# Altium schematic sheet DRIVER.SchDoc
size A4; SheetNumber: 3; SheetTotal: 4
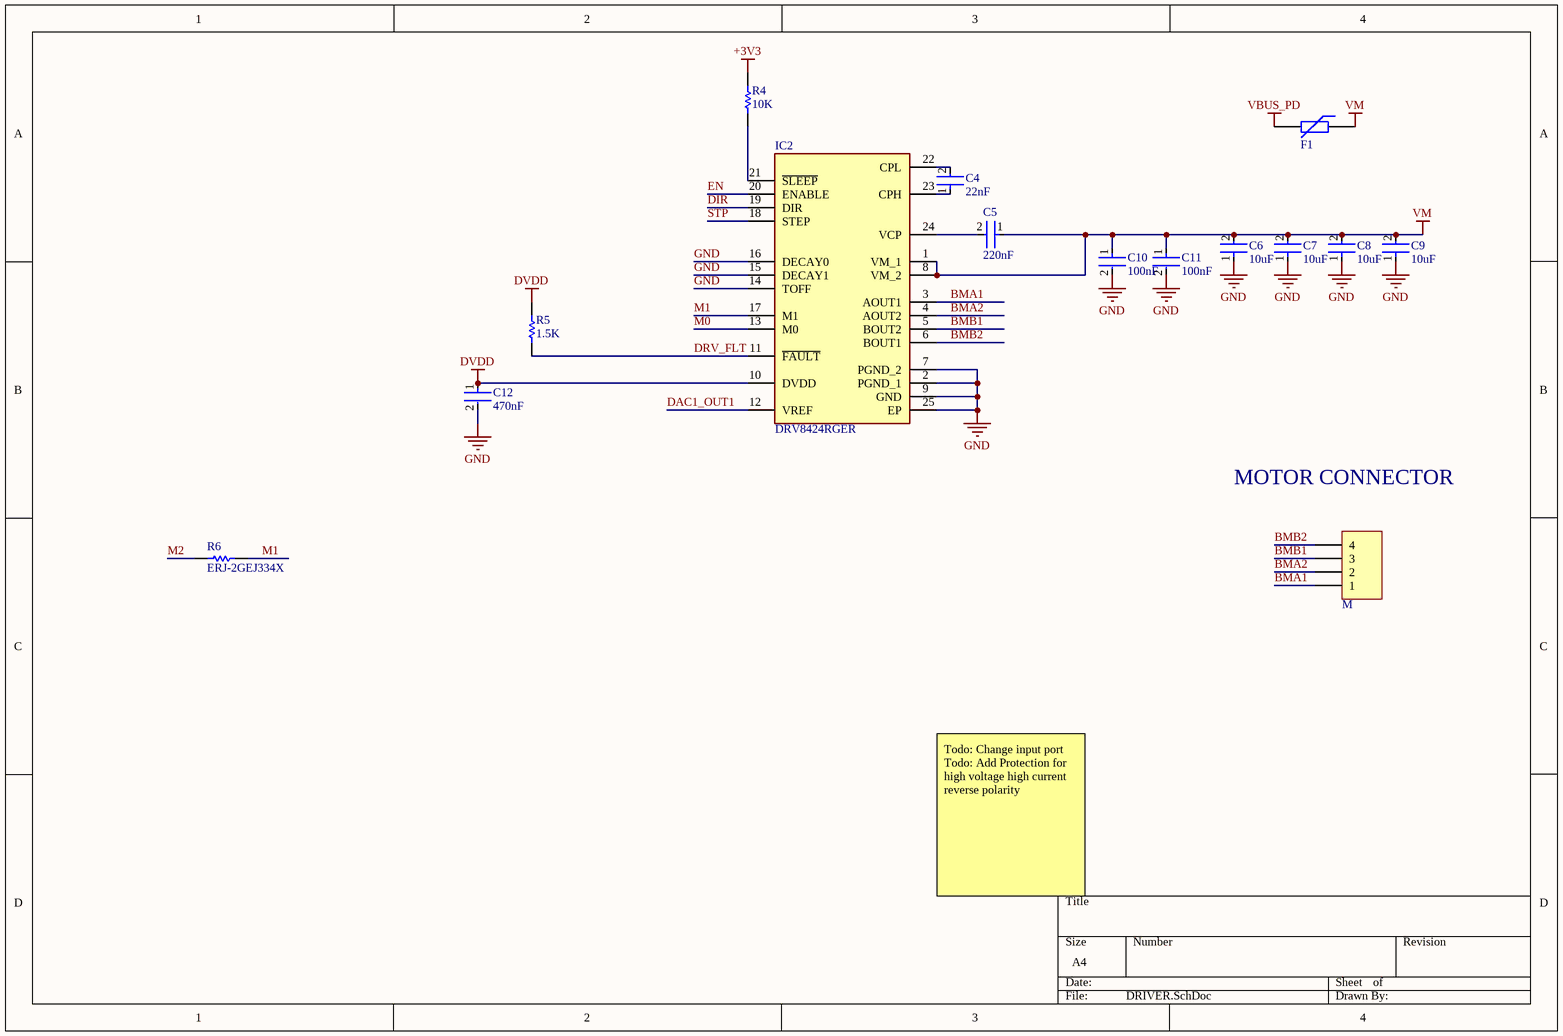
[diagram p0: DRIVER.SchDoc]

## Parts
C4  Capacitance: 22nF  [FP-C1005-050-0_05-IPC_C]  (hidden comment: C1005X7R1H223K050BB)
C5  Capacitance: 220nF  [FP-C1005-050-0_05-IPC_B]  (hidden comment: C1005X7R1V224K050BC)
C6  Capacitance: 10uF  [FP-C2012-125-0_2-IPC_B]  (hidden comment: C2012X5R1V106K125AC)
C7  Capacitance: 10uF  [FP-C2012-125-0_2-IPC_B]  (hidden comment: C2012X5R1V106K125AC)
C8  Capacitance: 10uF  [FP-C2012-125-0_2-IPC_B]  (hidden comment: C2012X5R1V106K125AC)
C9  Capacitance: 10uF  [FP-C2012-125-0_2-IPC_B]  (hidden comment: C2012X5R1V106K125AC)
C10  Capacitance: 100nF  [FP-C1005-050-0_05-IPC_C]  (hidden comment: C1005X7R1H104K050BB)
C11  Capacitance: 100nF  [FP-C1005-050-0_05-IPC_C]  (hidden comment: C1005X7R1H104K050BB)
C12  Capacitance: 470nF  [FP-C1005-050-0_05-IPC_B]  (hidden comment: C1005X5R1V474K050BC)
F1  (no value)  [R1206]
IC2  DRV8424RGER  [QFN50P400X400X100-25N-D]
M  CONN-4  [XH-4]  (value not drawn)
R4  RESISTANCE: 10K  [RESC1005X40X25ML05T05]  (hidden comment: ERJ-2GEJ103X)
R5  RESISTANCE: 1.5K  [RESC1005X40X25NL05T05]  (hidden comment: ERJ-2GEJ152X)
R6  ERJ-2GEJ334X  [RESC1005X40X25ML05T05]

## Nets
+3V3: R4.1
DVDD: C12.1 IC2.10(DVDD) R5.1
GND: C6.1 C7.1 C8.1 C9.1 C10.2 C11.2 C12.2 IC2.2(PGND_1) IC2.7(PGND_2) IC2.9(GND) IC2.14(TOFF) IC2.15(DECAY1) IC2.16(DECAY0) IC2.25(EP)
VBUS_PD: F1.2
VM: C5.1 C6.2 C7.2 C8.2 C9.2 C10.1 C11.1 F1.1 IC2.1(VM_1) IC2.8(VM_2)
BMA1: IC2.3(AOUT1) M.1
BMA2: IC2.4(AOUT2) M.2
BMB1: IC2.5(BOUT2) M.3
BMB2: IC2.6(BOUT1) M.4
DAC1_OUT1: IC2.12(VREF)
DIR: IC2.19(DIR)
DRV_FLT: IC2.11(~{FAULT}) R5.2
EN: IC2.20(ENABLE)
M0: IC2.13(M0)
M1: IC2.17(M1) R6.2
M2: R6.1
STP: IC2.18(STEP)
NetC4_1: C4.1 IC2.23(CPH)
NetC4_2: C4.2 IC2.22(CPL)
NetC5_2: C5.2 IC2.24(VCP)
NetIC2_21: IC2.21(~{SLEEP}) R4.2

## Notes on the sheet
- MOTOR CONNECTOR
- Todo: Change input port
  Todo: Add Protection for high voltage high current reverse polarity

## Library data of the parts
C4 = CMP-08246-004483-1: Multilayer Ceramic Capacitors 22nF ±10% 50V X7R SMD 0402; Radiation Hardening: No; Voltage Rating: 50V; Case Code (Imperial): 0402; Depth: 0.5mm; REACH SVHC: No SVHC; Dielectric Material: Ceramic; Package Quantity: 1; Length: 1mm; Case/Package: 0402; Voltage Rating (DC): 50V; Tolerance: 10%; Resistor Type: Ceramic; Thickness: 0.022inch; Weight: 2.3E-05oz; Min Operating Temperature: -55°C; Dielectric: X7R; RoHS Compliant: Yes; Number of Pins: 2; Termination: SMD/SMT; Mount: Surface Mount; Series: C; Height: 0.5mm; Max Operating Temperature: 125°C; Packaging: Tape and Reel; Case Code (Metric): 1005; Width: 0.02inch; Construction: Flat; Lead Free: Lead Free
C5 = CMP-08246-006551-1: Multilayer Ceramic Capacitors 220nF ±10% 35V X7R SMD 0402; Thickness: 0.022inch; Mount: Surface Mount; Width: 0.02inch; Voltage Rating (DC): 35V; Package Quantity: 10000; Case Code (Imperial): 0402; Height: 0.5mm; Termination: SMD/SMT; Weight: 2.3E-05oz; RoHS Compliant: Yes; Min Operating Temperature: -55°C; Case/Package: 0402; Length: 0.039inch; Max Operating Temperature: 125°C; Dielectric Material: Ceramic; Dielectric: X7R; Tolerance: 10%; Packaging: Tape and Reel; Voltage Rating: 35V; Lead Free: Lead Free; Case Code (Metric): 1005
C6-C9 = CMP-08246-003469-1: Multilayer Ceramic Capacitors 10μF ±10% 35V X5R SMD 0805; Packaging: Tape and Reel; RoHS Compliant: Yes; Mount: Surface Mount; Series: C; Case/Package: 0805; Voltage Rating (DC): 35V; Lead Free: Lead Free; Weight: 0.000194oz; Max Operating Temperature: 85°C; Tolerance: 10%; Thickness: 0.057inch; Voltage Rating: 35V; Height: 1.25mm; Length: 0.079inch; Dielectric Material: Ceramic; Case Code (Imperial): 0805; Dielectric: X5R; Case Code (Metric): 2012; Min Operating Temperature: -55°C; Termination: SMD/SMT; Package Quantity: 2000; Width: 1.25mm; REACH SVHC: No SVHC
C10 C11 = CMP-2000-05393-2: Multilayer Ceramic Capacitors 100nF ±10% 50V X7R SMD 0402; Voltage: 50V; Dielectric Material: Ceramic; Min Operating Temperature: -55°C; Depth: 0.5mm; Radiation Hardening: No; RoHS Compliant: Yes; Voltage Rating (DC): 50V; Lead Free: Lead Free; Resistor Type: Ceramic; Height: 0.5mm; Dielectric: X7R; Thickness: 0.022inch; Case/Package: 0402; Case Code (Metric): 1005; Termination: SMD/SMT; Packaging: Tape and Reel; Max Operating Temperature: 125°C; Mount: Surface Mount; Package Quantity: 1; Width: 0.02inch; Weight: 2.3E-05oz; Voltage Rating: 50V; Tolerance: 10%; Construction: Flat; Case Code (Imperial): 0402; Length: 1mm; REACH SVHC: No SVHC; Series: C
C12 = CMP-08246-003870-1: Multilayer Ceramic Capacitors 470nF ±10% 35V X5R SMD 0402; Voltage Rating: 35V; Package Quantity: 10000; RoHS Compliant: Yes; Height: 0.5mm; Termination: SMD/SMT; Tolerance: 10%; Length: 0.039inch; Dielectric Material: Ceramic; Dielectric: X5R; Min Operating Temperature: -55°C; Case Code (Imperial): 0402; Mount: Surface Mount; Max Operating Temperature: 85°C; Voltage Rating (DC): 35V; Packaging: Tape and Reel; Width: 0.02inch; Case/Package: 0402; Series: C; Weight: 2.3E-05oz; Case Code (Metric): 1005; Lead Free: Lead Free; Thickness: 0.022inch
F1 = PTC: Published: 24-Mar-1999; PackageVersion: Mar-2003; PackageReference: 6-0805
IC2 = DRV8424RGER: Integrated Circuit; Manufacturer_Name: Texas Instruments; Datasheet Link: https://www.ti.com/lit/ds/symlink/drv8424e.pdf?ts=1606468050255; Height: 1mm; Manufacturer_Part_Number: DRV8424RGER; Mouser Part Number: 595-DRV8424RGER; Mouser Price/Stock: https://www.mouser.co.uk/ProductDetail/Texas-Instruments/DRV8424RGER?qs=zW32dvEIR3vjkIn0AjQrCA%3D%3D; Arrow Part Number: DRV8424RGER; Arrow Price/Stock: null?region=nac
R4 = CMP-2002-00433-1: Manufacturer: Panasonic; Part Number: ERJ-2GEJ103X
R5 = CMP-1011-00078-2: Manufacturer: Panasonic; Part Number: ERJ-2GEJ152X
R6 = CMP-1011-00134-2: Manufacturer: Panasonic; Part Number: ERJ-2GEJ334X